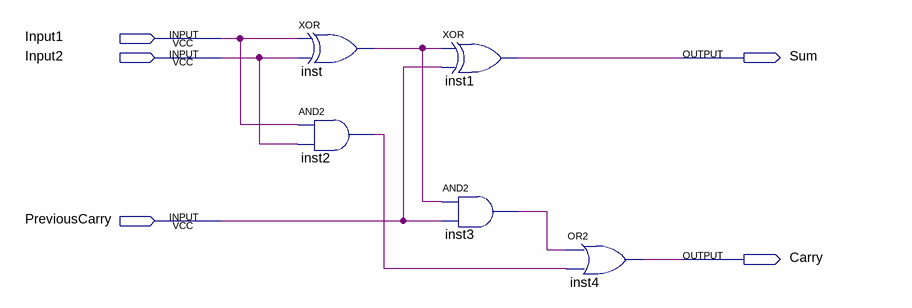
[diagram p0: schematic sheet]
// Quartus schematic fullAdder.bdf as structural Verilog: 5 symbols, 5 pins
module fullAdder (
  input  Input1,
  input  Input2,
  input  PreviousCarry,
  output Sum,
  output Carry
);

  wire inst2_out, inst3_out, inst_out;

  xor inst (inst_out, Input1, Input2);
  and inst2 (inst2_out, Input1, Input2);
  xor inst1 (Sum, inst_out, PreviousCarry);
  and inst3 (inst3_out, inst_out, PreviousCarry);
  or inst4 (Carry, inst3_out, inst2_out);
endmodule
